# Altium schematic sheet Sheet2.SchDoc
size A4
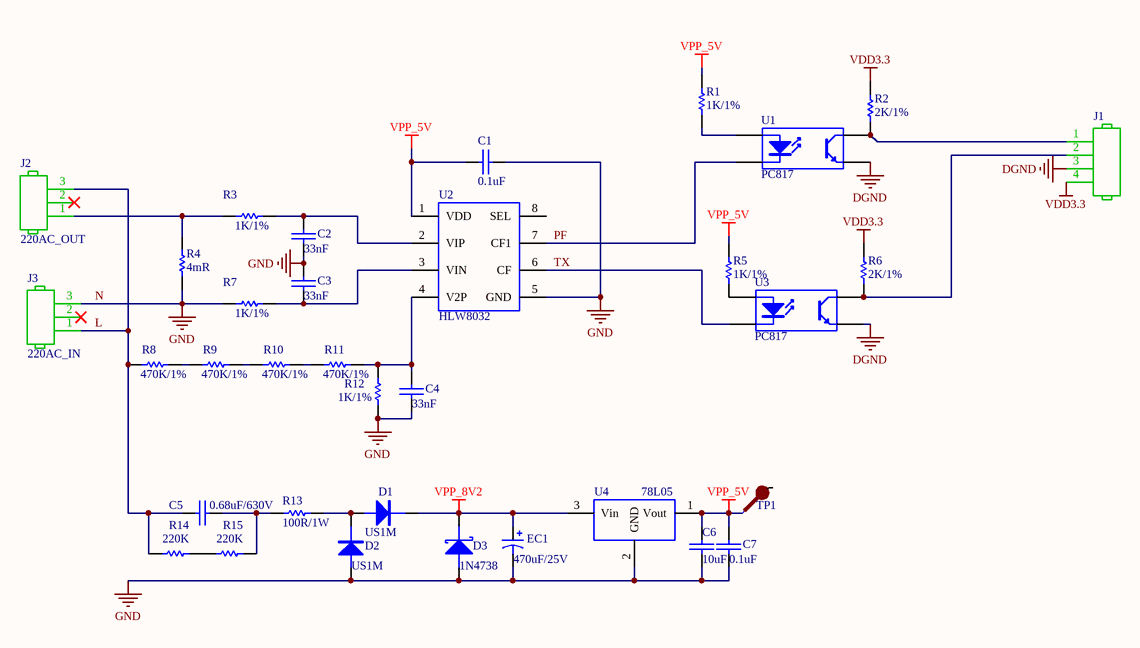
[diagram p0: Sheet2.SchDoc]

## Parts
C1  0.1uF  [C0805]
C2  33nF  [C0805]
C3  33nF  [C0805]
C4  33nF  [C0805]
C5  0.68uF/630V  [CBB-20-V]
C6  10uF  [C0805]
C7  0.1uF  [C0805]
D1  US1M  [DO-214AC(SMA)]
D2  US1M  [DO-214AC(SMA)]
D3  1N4738  [DO-214AC(SMA)]
EC1  470uF/25V  [C-IP-D8]
J1  (no value)  [J-XH2.54-4-IPV]
J2  220AC_OUT  [J-VH3.96-3-IPV]
J3  220AC_IN  [J-VH3.96-3-IPV]
R1  1K/1%  [R0805]
R2  2K/1%  [R0805]
R3  1K/1%  [R0805]
R4  4mR  [R-2512]
R5  1K/1%  [R0805]
R6  2K/1%  [R0805]
R7  1K/1%  [R0805]
R8  470K/1%  [R0805]
R9  470K/1%  [R0805]
R10  470K/1%  [R0805]
R11  470K/1%  [R0805]
R12  1K/1%  [R0805]
R13  100R/1W  [R-2512]
R14  220K  [R-1206]
R15  220K  [R-1206]
TP1  TEST POINT  [TP-D2]  (value not drawn)
U1  PC817  [SOP4-2.54-6.5]
U2  HLW8032  [SOP8-1.27-3.9]
U3  PC817  [SOP4-2.54-6.5]
U4  78L05  [SOT89]

## Nets
DGND: J1.3 U1.3(E) U3.3(E)
N: C1.2 C2.2 C3.1 C4.2 C6.1 C7.2 D2.1(A) D3.1(A) EC1.2 J3.3 R4.2 R7.1 R12.2 U2.5(GND) U4.2(GND)  [also labelled GND]
VDD3.3: J1.4 R2.2 R6.2
VPP_5V: C1.1 C6.2 C7.1 R1.2 R5.2 TP1.1(TEST) U2.1(VDD) U4.1(Vout)
VPP_8V2: D1.2(K) D3.2(K) EC1.1 U4.3(Vin)
L: C5.2 J2.3 J3.1 R8.1 R14.2
PF: U1.2(K) U2.7(CF1)
TX: U2.6(CF) U3.2(K)
NetC2_1: C2.1 R3.2 U2.2(VIP)
NetC3_2: C3.2 R7.2 U2.3(VIN)
NetC4_1: C4.1 R11.2 R12.1 U2.4(V2P)
NetC5_1: C5.1 R13.2 R15.1
NetD1_1: D1.1(A) D2.2(K) R13.1
NetJ1_1: J1.1 R2.1 U1.4(C)
NetJ1_2: J1.2 R6.1 U3.4(C)
NetJ2_1: J2.1 R3.1 R4.1
NetR1_1: R1.1 U1.1(A)
NetR5_1: R5.1 U3.1(A)
NetR8_2: R8.2 R9.1
NetR9_2: R9.2 R10.1
NetR10_2: R10.2 R11.1
NetR14_1: R14.1 R15.2

Not connected (* = marked no-connect by the designer): J2 2*; J3 2*; U2 8(SEL)

## Library data of the parts
C1-C4 = CAP: 33nF/50V/±10%/X7R; 零件名称: 贴片陶瓷电容
C5 = CAP: 0.68uF/630V/CBB电容/脚距20; 零件名称: 直插薄膜电容
C6 = CAP: 10uF/10V/±10%/X7R; 零件名称: 贴片陶瓷电容
C7 = CAP: 0.1uF/50V/±10%/X7R; 零件名称: 贴片陶瓷电容
D1 D2 = DIODE: 零件名称: 贴片快恢复二极管
D3 = DIODE-S: 零件名称: 贴片肖特基二极管
EC1 = CAP3: 470uF/25V/±20%/8*12; 零件名称: 直插电解电容
J1 = Header4: XH2.54_4PIN/直插立式; 零件名称: 直插接插件
J2 J3 = Header3: VH3.96-3PIN/2脚空置/直插立式; 零件名称: 直插接插件
R1-R3 R5-R12 = RES1: 1K/±5%/1/10W; 零件名称: 贴片电阻
R4 R14 R15 = RES1: 220K/±5%/1/4W; 零件名称: 贴片电阻
R13 = RES1: 100R/±5%/1W/绕线电阻; 零件名称: 直插碳膜电阻
TP1 = TEST: 零件名称: PCB测试点
U1 U3 = PC817: PC817C; 零件名称: 贴片光耦
U2 = HLW8012: 零件名称: 贴片电能采集IC
U4 = Voltage: L78L05ACUTR; 零件名称: 贴片降压IC